# EAGLE schematic et312 (EAGLE 7.3.0)

## Sheet 1 of 4
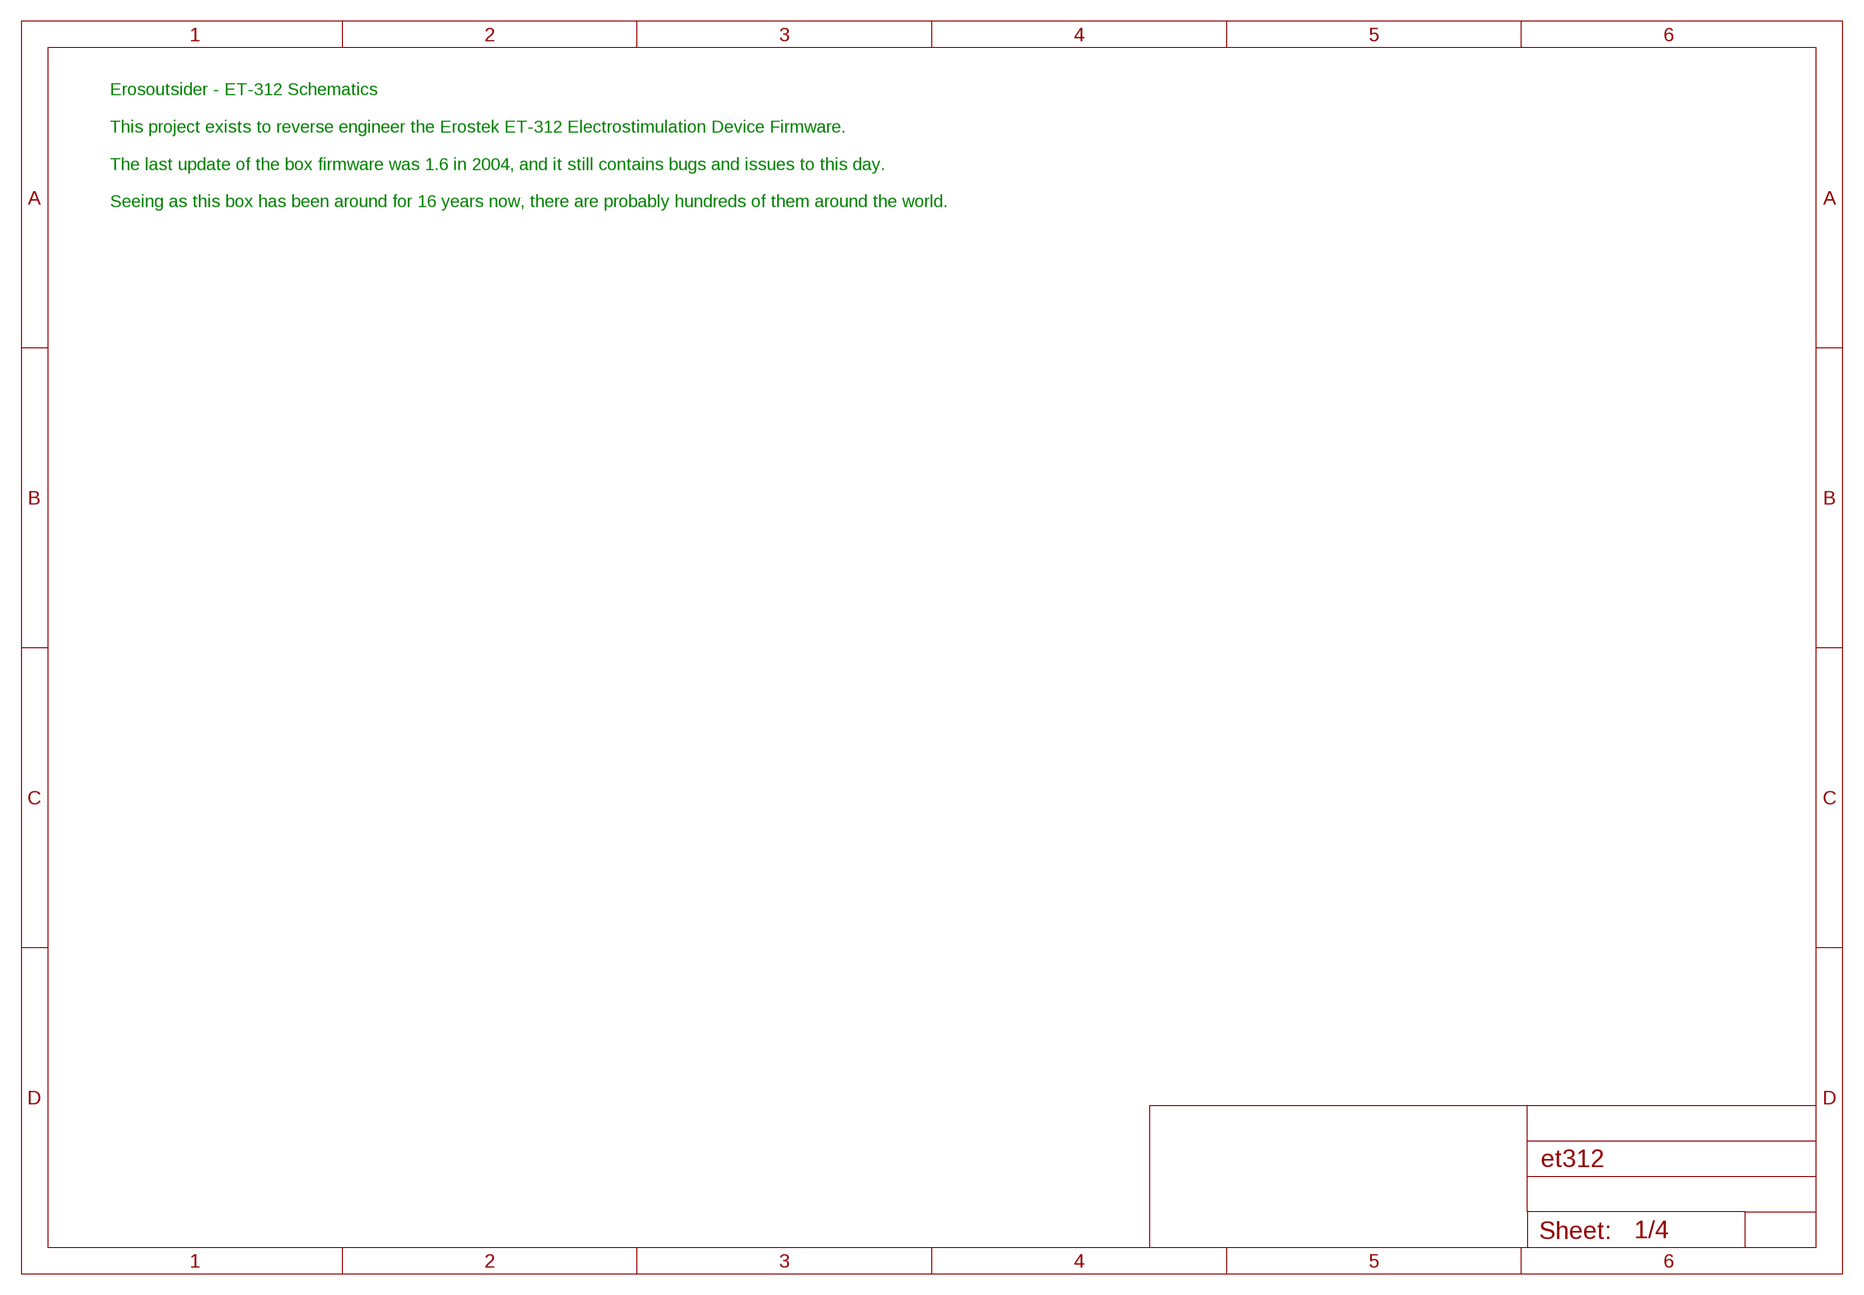
[diagram p0: schematic, sheet 1]

### Notes on the sheet
- Erosoutsider - ET-312 Schematics
  
  This project exists to reverse engineer the Erostek ET-312 Electrostimulation Device Firmware.
  
  The last update of the box firmware was 1.6 in 2004, and it still contains bugs and issues to this day.
  
  Seeing as this box has been around for 16 years now, there are probably hundreds of them around the world.

## Sheet 2 of 4
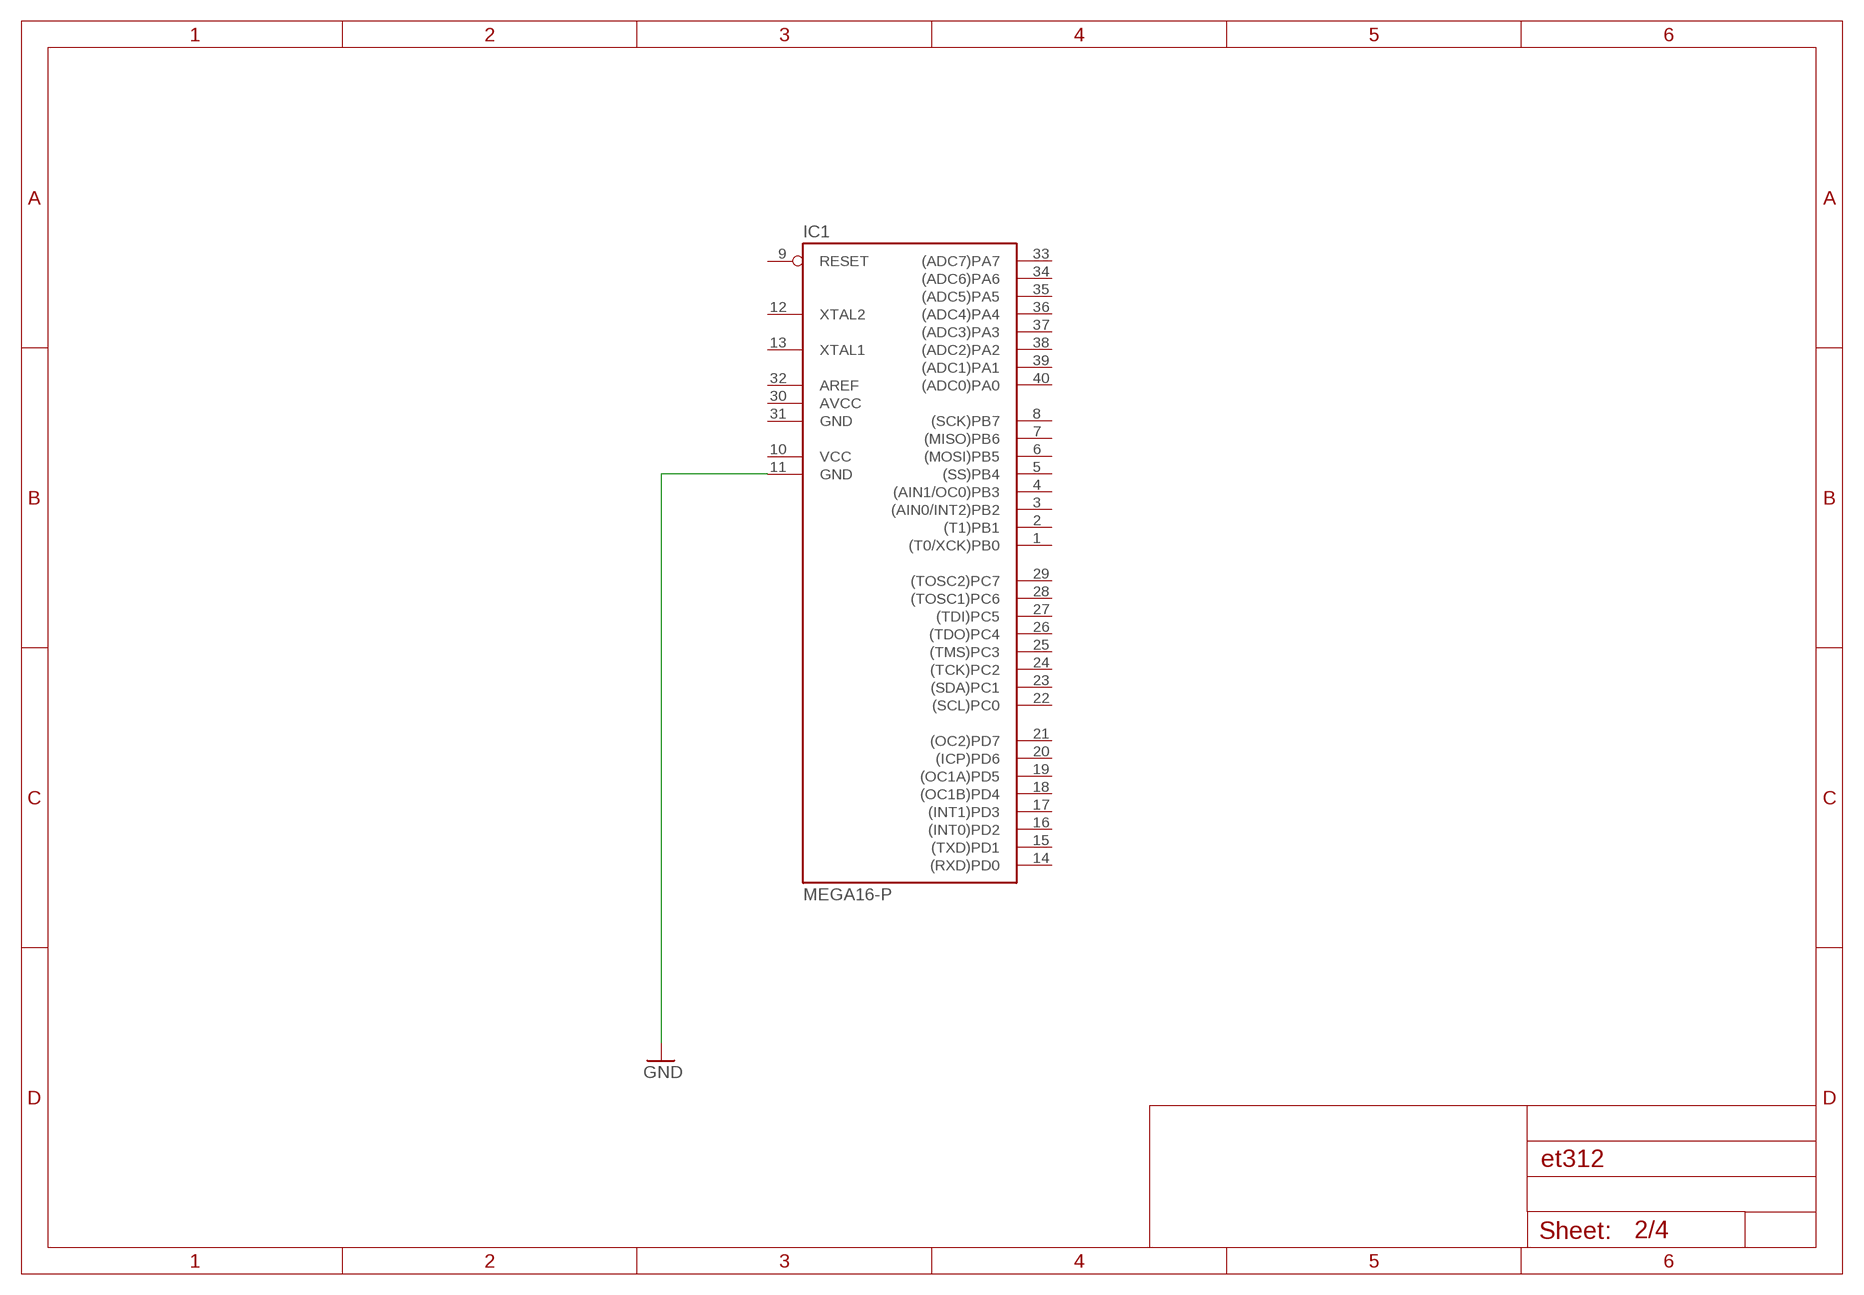
[diagram p1: schematic, sheet 2]

### Parts
IC1  MEGA16-P  [DIL40]

### Nets
GND: IC1.11(GND)
Unconnected: IC1.1((T0/XCK)PB0) IC1.2((T1)PB1) IC1.3((AIN0/INT2)PB2) IC1.4((AIN1/OC0)PB3) IC1.5((SS)PB4) IC1.6((MOSI)PB5) IC1.7((MISO)PB6) IC1.8((SCK)PB7) IC1.9(RESET) IC1.12(XTAL2) IC1.13(XTAL1) IC1.14((RXD)PD0) IC1.15((TXD)PD1) IC1.16((INT0)PD2) IC1.17((INT1)PD3) IC1.18((OC1B)PD4) IC1.19((OC1A)PD5) IC1.20((ICP)PD6) IC1.21((OC2)PD7) IC1.22((SCL)PC0) IC1.23((SDA)PC1) IC1.24((TCK)PC2) IC1.25((TMS)PC3) IC1.26((TDO)PC4) IC1.27((TDI)PC5) IC1.28((TOSC1)PC6) IC1.29((TOSC2)PC7) IC1.32(AREF) IC1.33((ADC7)PA7) IC1.34((ADC6)PA6) IC1.35((ADC5)PA5) IC1.36((ADC4)PA4) IC1.37((ADC3)PA3) IC1.38((ADC2)PA2) IC1.39((ADC1)PA1) IC1.40((ADC0)PA0)

## Sheet 3 of 4
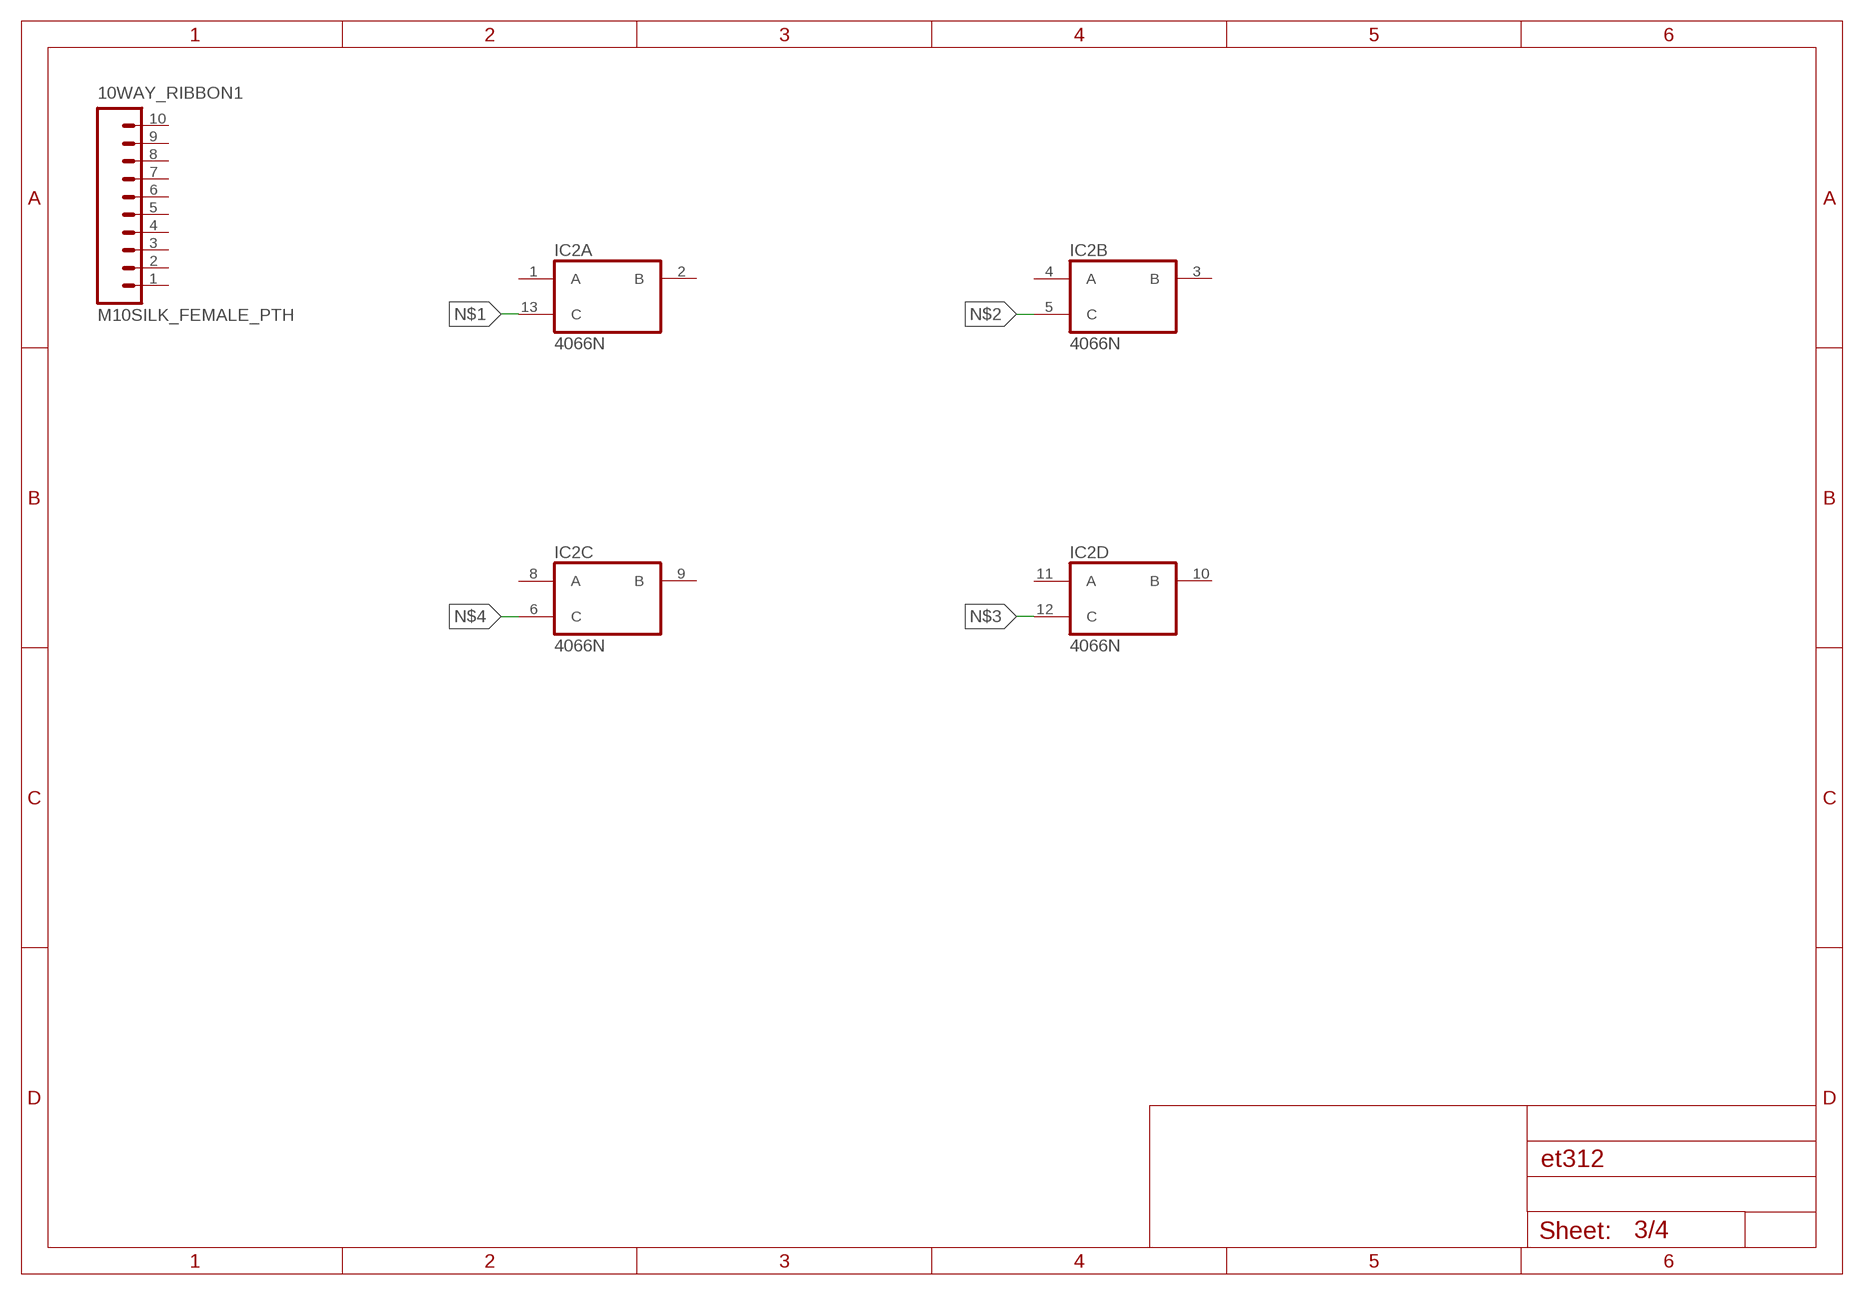
[diagram p2: schematic, sheet 3]

### Parts
10WAY_RIBBON1  M10SILK_FEMALE_PTH  [1X10]
IC2  4066N  [DIL14]

### Nets
N$1: IC2.13(A:C)
N$2: IC2.5(B:C)
N$3: IC2.12(D:C)
N$4: IC2.6(C:C)
Unconnected: 10WAY_RIBBON1.1 10WAY_RIBBON1.2 10WAY_RIBBON1.3 10WAY_RIBBON1.4 10WAY_RIBBON1.5 10WAY_RIBBON1.6 10WAY_RIBBON1.7 10WAY_RIBBON1.8 10WAY_RIBBON1.9 10WAY_RIBBON1.10 IC2.1(A:A) IC2.2(A:B) IC2.3(B:B) IC2.4(B:A) IC2.8(C:A) IC2.9(C:B) IC2.10(D:B) IC2.11(D:A)

## Sheet 4 of 4
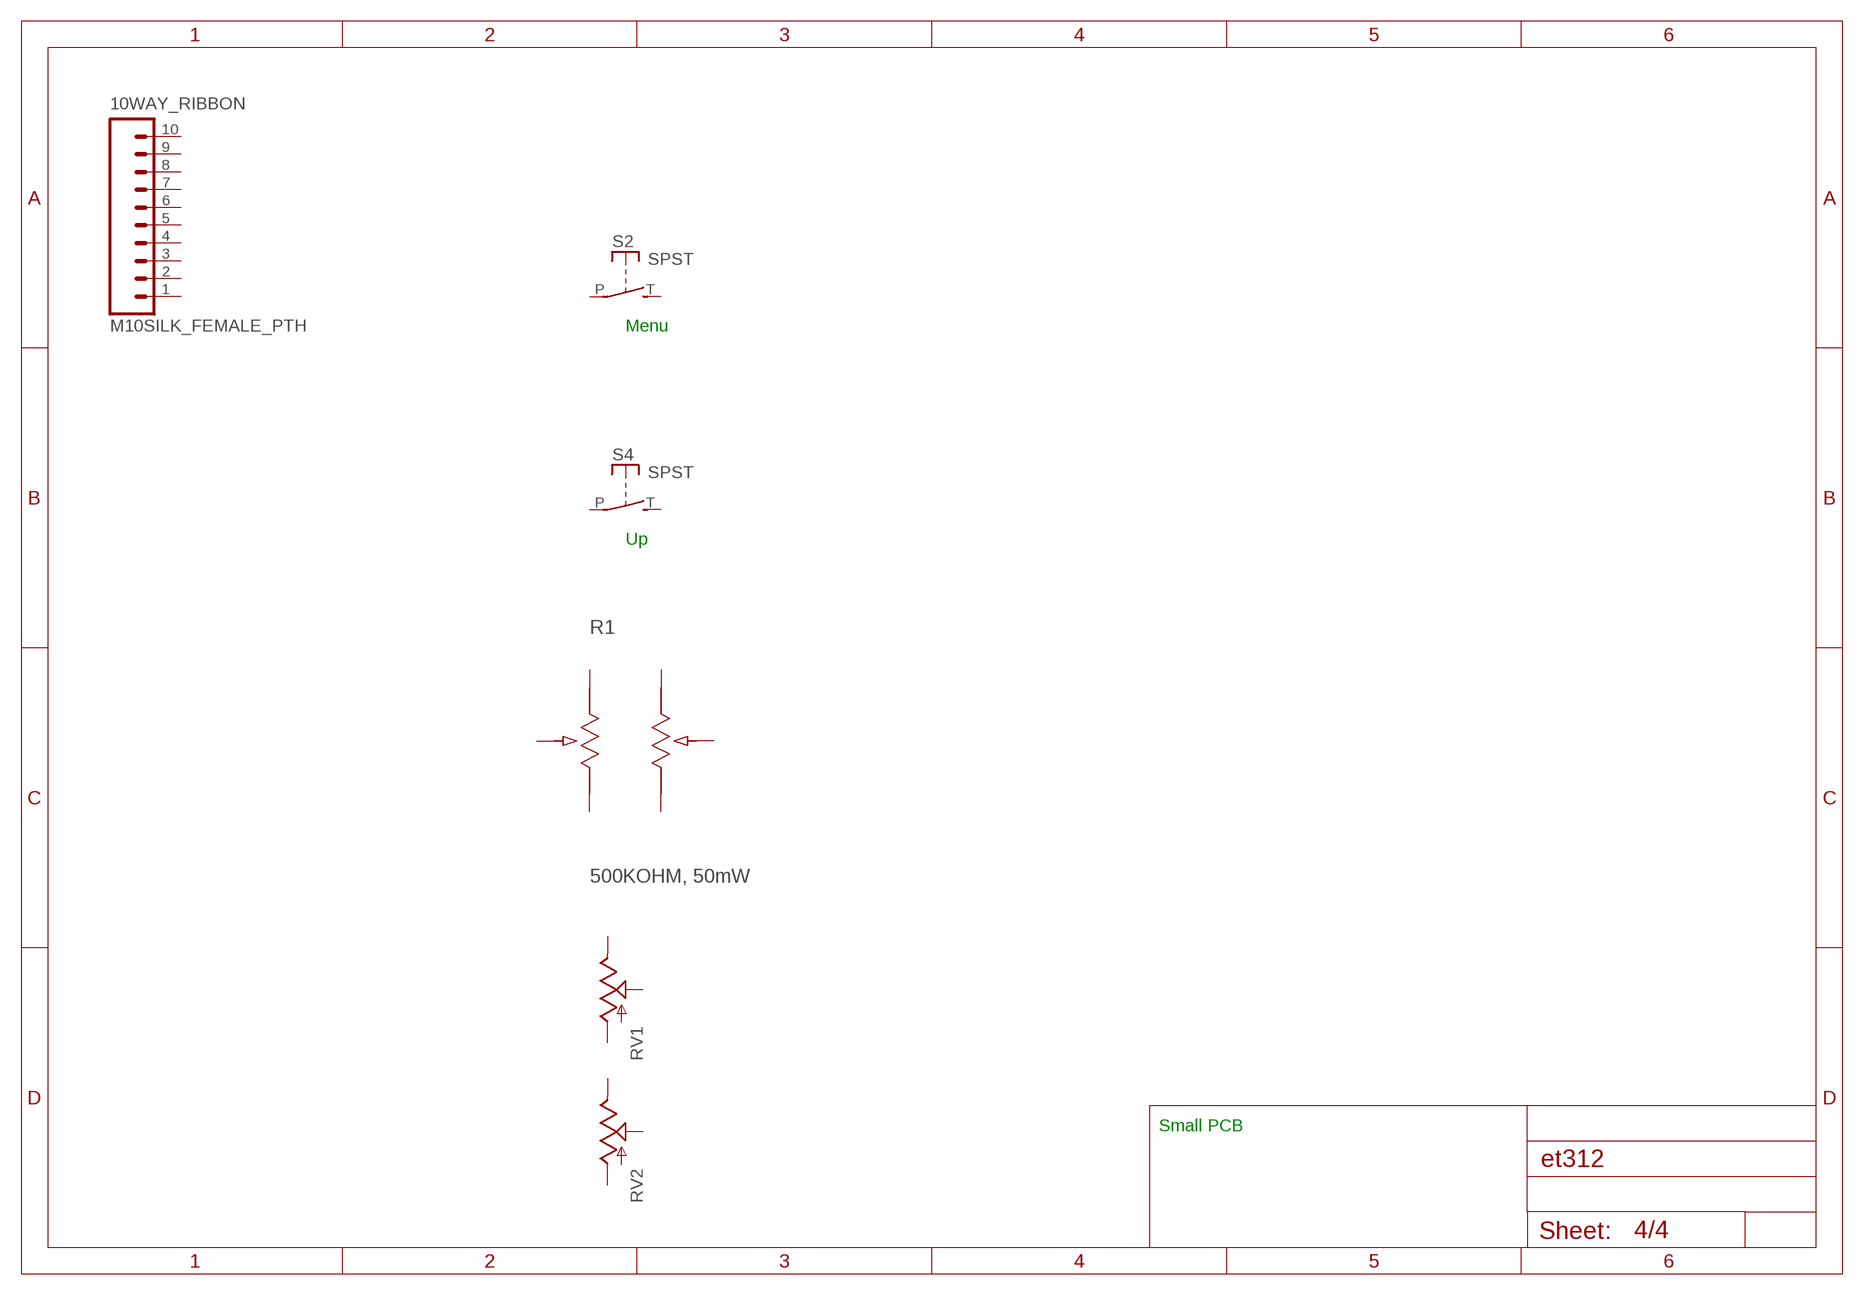
[diagram p3: schematic, sheet 4]

### Parts
10WAY_RIBBON  M10SILK_FEMALE_PTH  [1X10]
R1  500KOHM, 50mW  EVJC20F02A14-JC2  [POT_EVJC20]
RV1  POT  [ALPS_POT]
RV2  POT  [ALPS_POT]
S2  SPST  [JUDCOSPST]
S4  SPST  [JUDCOSPST]
Unconnected: 10WAY_RIBBON.1 10WAY_RIBBON.2 10WAY_RIBBON.3 10WAY_RIBBON.4 10WAY_RIBBON.5 10WAY_RIBBON.6 10WAY_RIBBON.7 10WAY_RIBBON.8 10WAY_RIBBON.9 10WAY_RIBBON.10 R1.1 R1.1' R1.2 R1.2' R1.3 R1.3' RV1.P$1(E) RV1.P$2(S) RV1.P$3(A) RV2.P$1(E) RV2.P$2(S) RV2.P$3(A) S2.P S2.T(S) S4.P S4.T(S)

### Notes on the sheet
- Menu
- Up
- Small PCB

## Power pins joined to a net without a drawn wire
AVCC: IC1.30(AVCC)
GND: IC1.31(GND)
VCC: IC1.10(VCC)
VDD: IC2.14(P:VDD)
VSS: IC2.7(P:VSS)

## Library data of the parts
10WAY_RIBBON 10WAY_RIBBON1 = SparkFun-Connectors:M10: Header 10 Standard 10-pin 0.1" header. Use with straight break away headers (SKU : PRT-00116), right angle break away headers (PRT-00553), swiss pins (PRT-00743), machine pins (PRT-00117), and female headers (PRT-00115).; PROD_ID: CONN-11563
IC1 = atmel:MEGA16-P: MICROCONTROLLER 16 Kbytes FLASH 1 kbytes SRAM 512 bytes EEPROM USART 8-channel 10 bit ADC Source: avr.lbr; MPN: ATMEGA16-16PU; OC_FARNELL: 9171142; OC_NEWARK: 01M6885
IC2 = 40xx:4066: Quad bilateral ANALOG SWITCH
R1 = Panasonic-Trimmer_Potentiometers:EVJ: 12 mm Square Two-in-One Rotary Potentiometers (Dual Type); MPN: EVJC20F02A14; OC_FARNELL: 2284569; OC_NEWARK: 52W2256; PACKAGE: TH-POT; SUPPLIER: PANASONIC
RV1 RV2 = SparkFun-Electromechanical:POT
S2 S4 = adafruit:SPST: Judco 50-0015-00

## Net classes
0 default: width 0.4 mm
1 signal: width 0.254 mm
2 pwr: width 2 mm